# Altium schematic sheet YAW_POWER.schdoc
size 289 x 170 mm
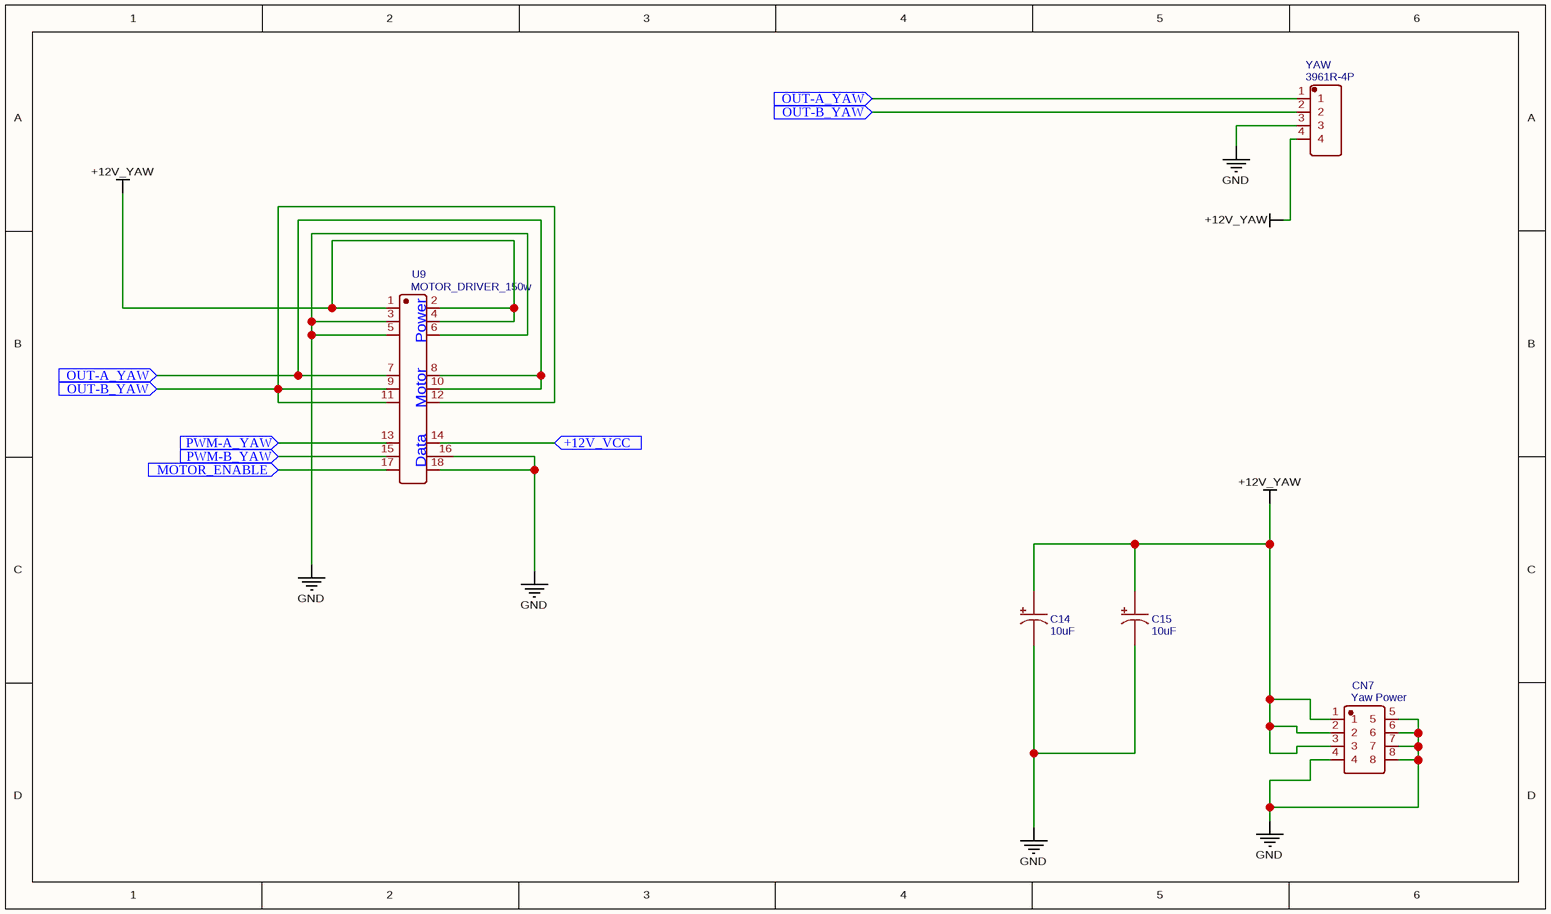
[diagram p0: YAW_POWER.schdoc]

## Parts
C14  10uF  [CAP-SMD_BD4.0-L4.3-W4.3-FD]
C15  10uF  [CAP-SMD_BD4.0-L4.3-W4.3-FD]
CN7  Yaw Power  [CONN-TH_8P-P4.20_X9357WV-2-04-N2SN]
U9  MOTOR_DRIVER_150w  [MOTOR_DRIVE_150W_MODULE]
YAW  3961R-4P  [CONN-TH_4P-P3.96_3961R-4P]

## Ports
+12V_VCC (in), MOTOR_ENABLE (in), OUT-A_YAW (in), OUT-B_YAW (in), PWM-A_YAW (in), PWM-B_YAW (in)

## Nets
+12V_YAW: C14.1 C15.1 CN7.1 CN7.2 CN7.3 U9.1(+12V_YAW) U9.2(+12V_YAW) U9.4(+12V_YAW) YAW.4
GND: C14.2 C15.2 CN7.4 CN7.5 CN7.6 CN7.7 CN7.8 U9.3(GND) U9.5(GND) U9.6(GND) U9.16(GND) U9.18(GND) YAW.3
+12V_VCC: U9.14(+12V_VCC) ; port +12V_VCC
MOTOR_ENABLE: U9.17(MOTOR_ENABLE) ; port MOTOR_ENABLE
OUT-A_YAW: U9.7(OUT-A_YAW) U9.8(OUT-A_YAW) U9.10(OUT-A_YAW) YAW.1 ; port OUT-A_YAW
OUT-B_YAW: U9.9(OUT-B_YAW) U9.11(OUT-B_YAW) U9.12(OUT-B_YAW) YAW.2 ; port OUT-B_YAW
PWM-A_YAW: U9.13(PWM-A_YAW) ; port PWM-A_YAW
PWM-B_YAW: U9.15(PWM-B_YAW) ; port PWM-B_YAW

## Notes on the sheet
- (in symbol MOTOR_DRIVER_150w) Power; Motor; Data

## Library data of the parts
C14 C15 = 10uF: BOM_Manufacturer: ROQANG; BOM_Manufacturer Part: VT1E100M0405; nameAlias: Capacitance; Contributor: LCSC; BOM_Supplier: LCSC; BOM_Supplier Part: C213486; BOM_JLCPCB Part Class: Extended Part; JLCPCB Part Class: Extended Part; spicePre: C; spiceSymbolName: VT1E100M0405
CN7 = Yaw Power: BOM_Manufacturer: XKB Enterprise; BOM_Manufacturer Part: X9357WV-2*04-N2SN; Contributor: LCSC; BOM_Supplier: LCSC; BOM_Supplier Part: C519240; BOM_JLCPCB Part Class: Extended Part; spicePre: C; spiceSymbolName: X9357WV-2*04-N2SN
U9 = MOTOR_DRIVER_150w: Contributor: digitalman; spicePre: U; spiceSymbolName: MOTOR_DRIVER_150w
YAW = 3961R-4P: BOM_Manufacturer: Ckmtw; Contributor: LCSC; BOM_Supplier: LCSC; BOM_Manufacturer Part: 3961R-4P; BOM_Supplier Part: C138427; BOM_JLCPCB Part Class: Extended Part; spicePre: C; spiceSymbolName: 3961R-4P